# Altium schematic sheet P08 CPU_4.SchDoc
size 420 x 297 mm
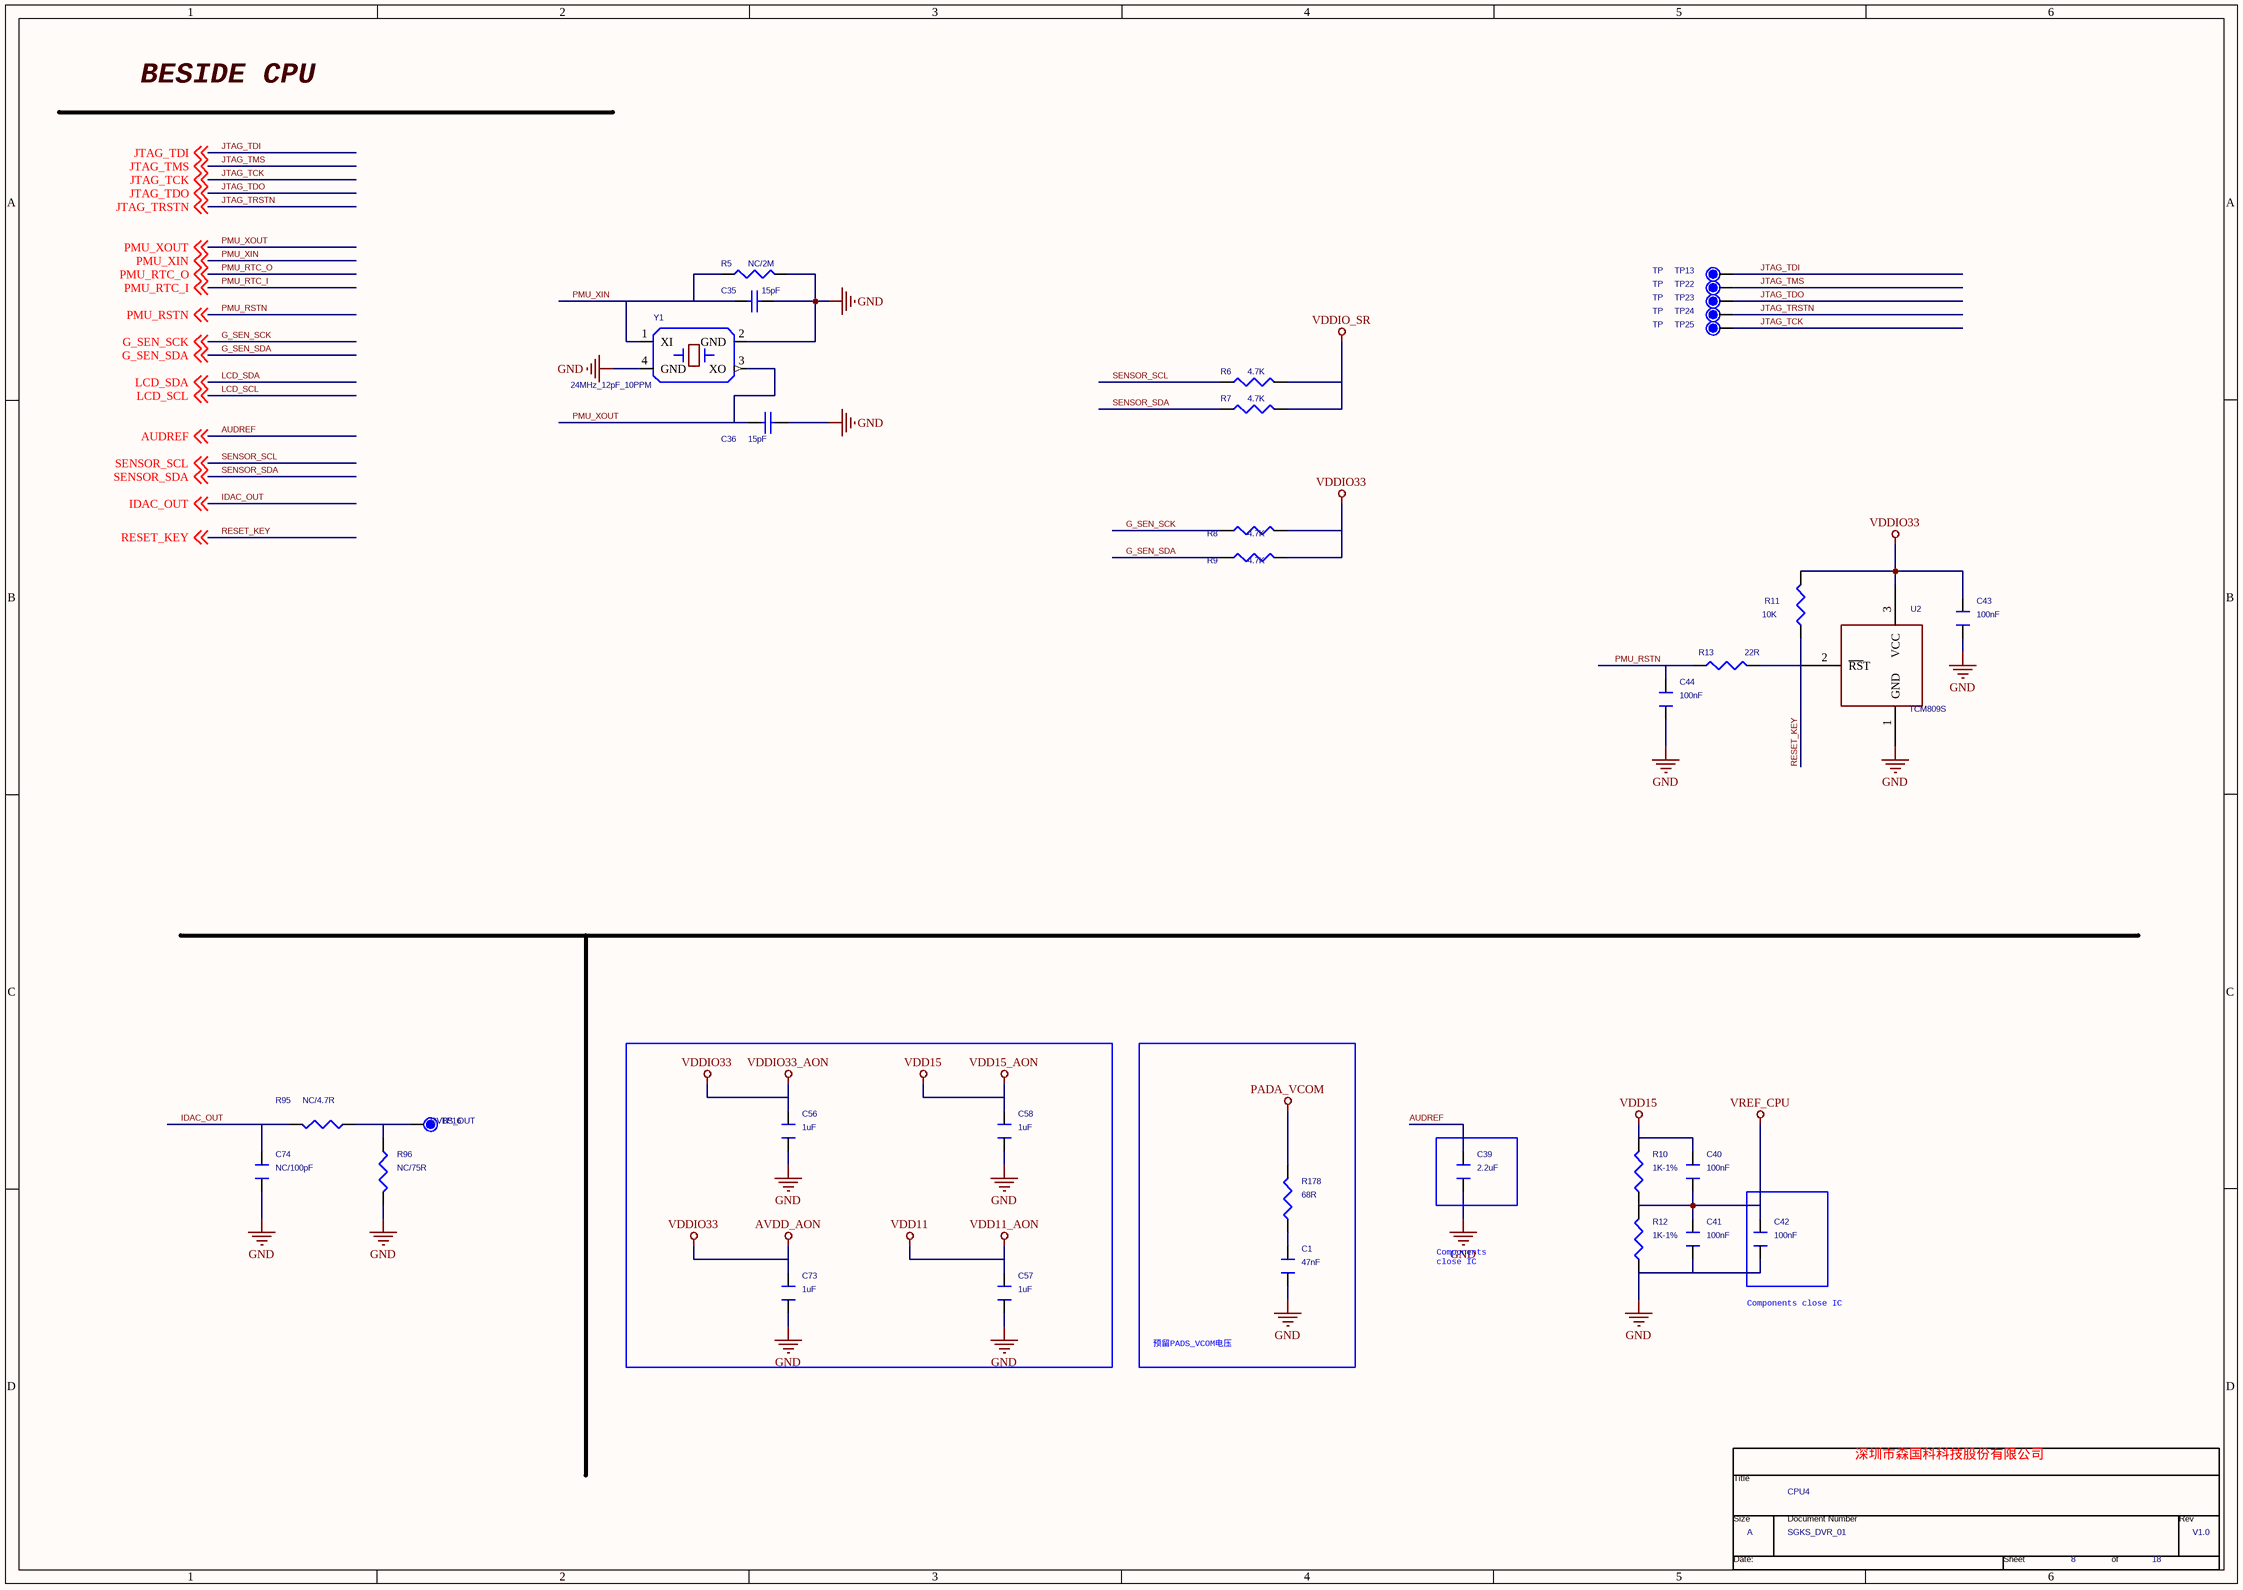
[diagram p0: P08 CPU_4.SchDoc]

## Parts
*  Page Count: 18  Page Number: 8  Page Size: A  Title: CPU4  RevCode: V1.0  Doc: SGKS_DVR_01  (hidden comment: TitleBlock0)  (graphical)
C1  47nF  [C0402]
C35  15pF  [C0402]
C36  15pF  [C0402]
C39  2.2uF  [C0402]
C40  100nF  [C0402]
C41  100nF  [C0402]
C42  100nF  [C0402]
C43  100nF  [C0402]
C44  100nF  [C0402]
C56  1uF  [C0402]
C57  1uF  [C0402]
C58  1uF  [C0402]
C73  1uF  [C0402]
C74  NC/100pF  [C0402]
R5  NC/2M  [R0603/SMD]
R6  4.7K  [R0603/SMD]
R7  4.7K  [R0603/SMD]
R8  4.7K  [R0402]
R9  4.7K  [R0402]
R10  1K-1%  [R0402]
R11  10K  [R0402]
R12  1K-1%  [R0402]
R13  22R  [R0402]
R95  NC/4.7R  [R0402]
R96  NC/75R  [R0402]
R178  68R  [R0402]
TP13  TP  [TP/SMD/D1.0]
TP16  CVBS_OUT  [TP/SMD/D1.0]
TP22  TP  [TP/SMD/D1.0]
TP23  TP  [TP/SMD/D1.0]
TP24  TP  [TP/SMD/D1.0]
TP25  TP  [TP/SMD/D1.0]
U2  TCM809S  [SOT-23]
Y1  24MHz_12pF_10PPM  [OSC4_SMD_50X32]

## Blocks framed on the sheet
预留PADS_VCOM电压: C1 R178

## Nets
AVDD_AON: C43.2 C56.2 C73.2 R8.2 R9.2 R11.1 U2.3(VCC)  [also labelled VDDIO33, VDDIO33_AON]
GND: C1.1 C35.2 C36.2 C39.2 C41.2 C42.2 C43.1 C44.1 C56.1 C57.1 C58.1 C73.1 C74.2 R5.2 R12.1 R96.2 U2.1(GND) Y1.2(GND) Y1.4(GND)
PADA_VCOM: R178.2
VDD11: C57.2  [also labelled VDD11_AON]
VDD15: C40.1 C58.2 R10.2  [also labelled VDD15_AON]
VDDIO_SR: R6.2 R7.2
VREF_CPU: C40.2 C41.1 C42.1 R10.1 R12.2
AUDREF: C39.1 ; off-sheet AUDREF
G_SEN_SCK: R8.1 ; off-sheet G_SEN_SCK
G_SEN_SDA: R9.1 ; off-sheet G_SEN_SDA
IDAC_OUT: C74.1 R95.2 ; off-sheet IDAC_OUT
JTAG_TCK: TP25.1 ; off-sheet JTAG_TCK
JTAG_TDI: TP13.1 ; off-sheet JTAG_TDI
JTAG_TDO: TP23.1 ; off-sheet JTAG_TDO
JTAG_TMS: TP22.1 ; off-sheet JTAG_TMS
JTAG_TRSTN: TP24.1 ; off-sheet JTAG_TRSTN
PMU_RSTN: C44.2 R13.2 ; off-sheet PMU_RSTN
PMU_XIN: C35.1 R5.1 Y1.1(XI) ; off-sheet PMU_XIN
PMU_XOUT: C36.1 Y1.3(XO) ; off-sheet PMU_XOUT
RESET_KEY: R11.2 R13.1 U2.2(~{RS}T) ; off-sheet RESET_KEY
SENSOR_SCL: R6.1 ; off-sheet SENSOR_SCL
SENSOR_SDA: R7.1 ; off-sheet SENSOR_SDA
NetC1_2: C1.2 R178.1
NetR95_1: R95.1 R96.1 TP16.1

## Notes on the sheet
- BESIDE CPU
- Components
  close IC
- Components close IC
- 深圳市森国科科技股份有限公司
- (in symbol TitleBlock0) Title; Size; Document Number; Rev; Date:; Sheet; of

## Library data of the parts
C1 C43 C44 C56-C58 C73 = CAPACITOR: PAGE: 1
C35 C36 = CAP/CB_0: Part Description: Chip Capacitor
C39-C42 C74 = CAPACITOR_0_Dup3
R5 = RES/SMD_0: Part Description: Chip Resistor
R6 R7 = RES/SMD_1: Part Description: Chip Resistor; Type: 贴片电阻
R8 R9 = ?_0: 规格型号: 原材料; 元件类别: 电阻100K,±5%,1/16W,0402 每盘10K; 元件编号: 电阻; 备注: YCL0465; Vendor: R0402
R10 R178 = RESISTOR_Dup1: RES - 200 ohm 0603 1/16W 1%; Num Pins: 2; Page: 5
R11 R13 = RESISTOR_Dup2
R12 R95 R96 = RESISTOR_Dup1: RES - 200 ohm 0603 1/16W 1%; Page: 5; Num Pins: 2
TP13 TP16 TP22-TP25 = TP_0: Part Description: Test Point; Type: NC
Y1 = CRYSTAL/4P: Type: 贴片晶振?
* = TitleBlock0: Page Create Date: March  8, 1995